# Altium project DLH_Project.PrjPCB
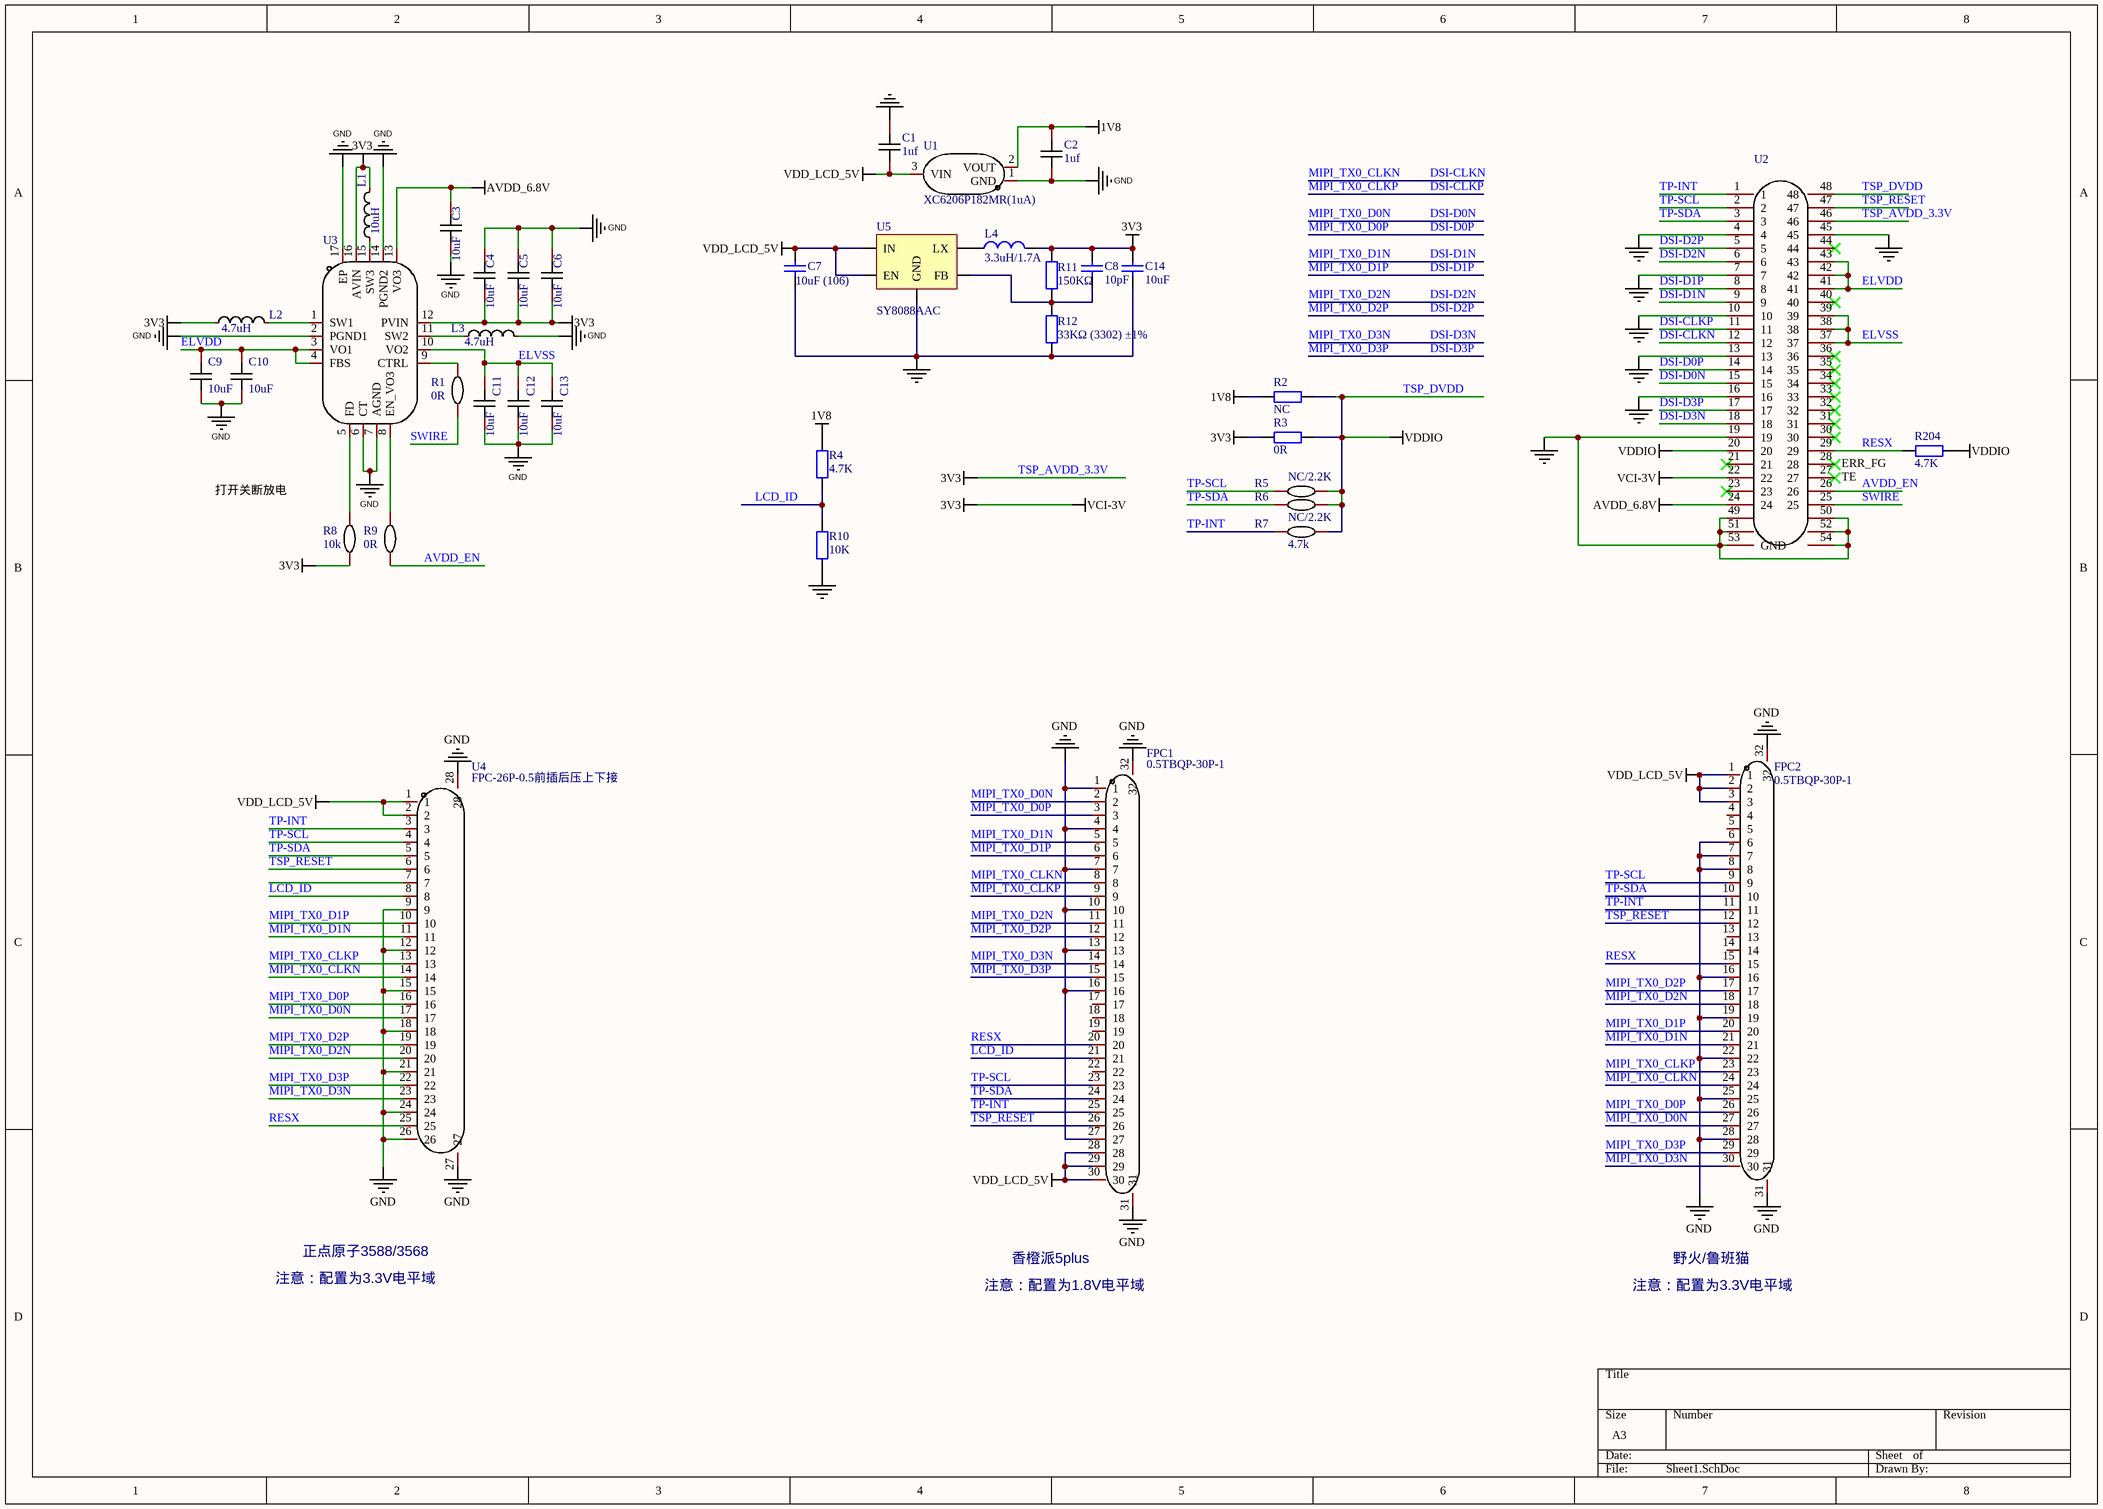
[diagram p0: Sheet1.SchDoc]
1 sheet, 38 parts. Net scope: global (net labels, ports and power ports of the same name join across sheets).
Board file: PCB1.PcbDoc

## Sheet Sheet1.SchDoc
size A3

### Parts
C1  1uf  [C0603]
C2  1uf  [C0603]
C3  10uF  [C0603]
C4  10uF  [C0603]
C5  10uF  [C0603]
C6  10uF  [C0603]
C7  10uF (106)  [C 0603]
C8  10pF  [C 0603]
C9  10uF  [C0603]
C10  10uF  [C0603]
C11  10uF  [C0603]
C12  10uF  [C0603]
C13  10uF  [C0603]
C14  10uF  [C 0603]
FPC1  0.5TBQP-30P-1  [FPC-SMD_30P-P0.50_0.5TBQS-30P-1]
FPC2  0.5TBQP-30P-1  [FPC-SMD_30P-P0.50_0.5TBQS-30P-1]
L1  10uH  [IND-SMD_L2.7-W2.0]
L2  4.7uH  [IND-SMD_L2.7-W2.0]
L3  4.7uH  [IND-SMD_L2.7-W2.0]
L4  3.3uH/1.7A  [1008]
R1  0R  [R0603]
R2  NC  [R 0603]
R3  0R  [R 0603]
R4  4.7K  [R 0603]
R5  NC/2.2K  [R0603]
R6  NC/2.2K  [R0603]
R7  4.7k  [R0603]
R8  10k  [R0603]
R9  0R  [R0603]
R10  10K  [R 0603]
R11  150KΩ  [R 0603]
R12  33KΩ (3302) ±1%  [R 0603]
R204  4.7K  [R 0603]
U1  XC6206P182MR(1uA)  [SOT-23-3_L2.9-W1.6-P1.90-LS2.8-BR]
U2  24-5857-048-201-829+  [BTB-24-5857-048]  (value not drawn)
U3  SGM3836AYTQ16G/TR  [TQFN-16_L3.0-W3.0-P0.50-BL-EP1.7]  (value not drawn)
U4  FPC-26P-0.5前插后压上下接  [FPC-SMD_26P-P0.50_C9900017209]
U5  SY8088AAC  [SOT23-5N]

### Nets
1V8: C2.1 R2.1 R4.1 U1.2(VOUT)
AVDD_6.8V: C3.2 U2.24 U3.13(VO3)
GND: C1.1 C2.2 C3.1 C4.2 C5.2 C6.2 C7.1 C9.1 C10.1 C11.1 C12.1 C13.1 C14.1 FPC1.1 FPC1.4 FPC1.7 FPC1.10 FPC1.13 FPC1.16 FPC1.27 FPC1.31 FPC1.32 FPC2.6 FPC2.7 FPC2.8 FPC2.16 FPC2.19 FPC2.22 FPC2.25 FPC2.28 FPC2.31 FPC2.32 L3.2 R10.1 R12.1 U1.1(GND) U2.4 U2.7 U2.10 U2.13 U2.16 U2.19 U2.45 U2.49 U2.50 U2.51 U2.52 U2.53(GND) U2.54 U3.2(PGND1) U3.6(CT) U3.7(AGND) U3.14(PGND2) U3.17(EP) U4.9 U4.12 U4.15 U4.18 U4.21 U4.24 U4.26 U4.27 U4.28 U5.2(GND)
TSP_AVDD_3.3V: C4.1 C5.1 C6.1 C8.2 C14.2 L1.2 L2.1 L4.2 R3.1 R8.1 R11.2 U2.22 U2.46 U3.12(PVIN) U3.16(AVIN)  [also labelled 3V3, VCI-3V]
TSP_DVDD: R2.2 R3.2 R5.2 R6.2 R7.2 R204.2 U2.20 U2.48  [also labelled VDDIO]
VDD_LCD_5V: C1.2 C7.2 FPC1.28 FPC1.29 FPC1.30 FPC2.1 FPC2.2 FPC2.3 U1.3(VIN) U4.1 U4.2 U5.1(EN) U5.4(IN)
AVDD_EN: R9.1 U2.26
DSI-CLKN: FPC1.8 FPC2.24 U2.12 U4.14  [also labelled MIPI_TX0_CLKN]
DSI-CLKP: FPC1.9 FPC2.23 U2.11 U4.13  [also labelled MIPI_TX0_CLKP]
DSI-D0N: FPC1.2 FPC2.27 U2.15 U4.17  [also labelled MIPI_TX0_D0N]
DSI-D0P: FPC1.3 FPC2.26 U2.14 U4.16  [also labelled MIPI_TX0_D0P]
DSI-D1N: FPC1.5 FPC2.21 U2.9 U4.11  [also labelled MIPI_TX0_D1N]
DSI-D1P: FPC1.6 FPC2.20 U2.8 U4.10  [also labelled MIPI_TX0_D1P]
DSI-D2N: FPC1.11 FPC2.18 U2.6 U4.20  [also labelled MIPI_TX0_D2N]
DSI-D2P: FPC1.12 FPC2.17 U2.5 U4.19  [also labelled MIPI_TX0_D2P]
DSI-D3N: FPC1.14 FPC2.30 U2.18 U4.23  [also labelled MIPI_TX0_D3N]
DSI-D3P: FPC1.15 FPC2.29 U2.17 U4.22  [also labelled MIPI_TX0_D3P]
ELVDD: C9.2 C10.2 U2.41 U2.42 U2.43 U3.3(VO1) U3.4(FBS)
ELVSS: C11.2 C12.2 C13.2 U2.37 U2.38 U2.39 U3.10(VO2)
LCD_ID: FPC1.21 R4.2 R10.2 U4.8
RESX: FPC1.20 FPC2.15 R204.1 U2.29 U4.25
SWIRE: R1.1 U2.25
TP-INT: FPC1.25 FPC2.11 R7.1 U2.1 U4.3
TP-SCL: FPC1.23 FPC2.9 R5.1 U2.2 U4.4
TP-SDA: FPC1.24 FPC2.10 R6.1 U2.3 U4.5
TSP_RESET: FPC1.26 FPC2.12 U2.47 U4.6
NetC8_1: C8.1 R11.1 R12.2 U5.5(FB)
NetL1_1: L1.1 U3.15(SW3)
NetL2_2: L2.2 U3.1(SW1)
NetL3_1: L3.1 U3.11(SW2)
NetL4_1: L4.1 U5.3(LX)
NetR1_2: R1.2 U3.9(CTRL)
NetR8_2: R8.2 U3.5(FD)
NetR9_2: R9.2 U3.8(EN_VO3)

Not connected (* = marked no-connect by the designer): FPC1 17 18 19 22; FPC2 4 5 13 14; U2 21* 23* 27* 28* 30* 31* 32* 33* 34* 35* 36* 40* 44*; U4 7

### Notes on the sheet
- 打开关断放电
- (near U2) TE
- ERR_FG
- 正点原子3588/3568
- 香橙派5plus
- 野火/鲁班猫
- 注意：配置为3.3V电平域
- 注意：配置为1.8V电平域

### Library data of the parts
C1-C6 C9-C13 = CAP_0603: Symbol: CapAcitance; Convert to PCB: yes; Device: CAP_0603; Add into BOM: yes; Supplier Footprint: 0603
  C1 C2: Name: 1uf; Value: 1uf
  C3-C6 C9-C13: Name: 10uF; Value: 10uF
C7 C14 = 0603 10uF (106) 10% 10V: 贴片电容; ComponentLink1Description: 供应商链接; ComponentLink1URL: http://www.szlcsc.com/product/details_20411.html; Package: 0603; Supplier: LC; SuppliersPartNumber: C19702
C8 = 0402 10pF (100) 5% 50V: 贴片电容; ComponentLink1Description: 供应商链接; ComponentLink1URL: http://www.szlcsc.com/product/details_33914.html; Package: 0402; Supplier: LC; SuppliersPartNumber: C32949
FPC1 FPC2 = 0.5TBQP-30P-1: Add into BOM: yes; Name: 0.5TBQP-30P-1; Symbol: 0.5TBQP-30P-1; Device: 0.5TBQP-30P-1; LCSC Part Name: 0.5TBQP-30P-1; Supplier Part: C3975120; Manufacturer Part: 0.5TBQP-30P-1; Supplier Footprint: FPC-30P-0.5mm; JLCPCB Part Class: 扩展库; Supplier: LCSC; Convert to PCB: yes
L1-L3 = GNR2512PA-2R2M: 电感值:2.2uH;精度:±20%;额定电流:1.3A;; Manufacturer: gotrend(高创科技); Add into BOM: yes; Tolerance: ±20%; Rated Current: 1.3A; DC Resistance (DCR): 155mΩ; Symbol: GNR2512PA-2R2M; Device: GNR2512PA-2R2M; LCSC Part Name: 2.2uH ±20%; Supplier Part: C142404; Manufacturer Part: GNR2512PA-2R2M; Supplier Footprint: SMD,2.7x2.2x1.2mm; JLCPCB Part Class: 扩展库; Datasheet: https://atta.szlcsc.com/upload/public/pdf/source/20171113/C142411_15105615305361115979.pdf; Supplier: LCSC; Convert to PCB: yes
  L1: Name: 10uH; Value: 10uH
  L2 L3: Name: 4.7uH; Value: 4.7uH
L4 = Inductor: 电感
R1 R5-R9 = Res_0603: Symbol: 电阻; Convert to PCB: yes; Device: Res_0603; Add into BOM: yes; Supplier Footprint: 0603
  R1 R9: Name: 0R; Value: 0R
  R5 R6: Name: NC/2.2K; Value: NC/2.2K
  R7: Name: 4.7k; Value: 4.7k
  R8: Name: 10k; Value: 10k
R2-R4 R10 R204 = R: 贴片电阻; 版权归属: 源创客; BOM名称: 贴片电阻; 学习资源: www.ooocke.com
R11 = 0402 150KΩ (1503) 1%: 贴片电阻; ComponentLink1Description: 供应商链接; ComponentLink1URL: http://www.szlcsc.com/product/details_26498.html; Package: 0402; Supplier: LC; SuppliersPartNumber: C25755
R12 = 0402 33KΩ (3302) 1%: 贴片电阻; ComponentLink1Description: 供应商链接; ComponentLink1URL: http://www.szlcsc.com/product/details_26522.html; Package: 0402; Supplier: LC; SuppliersPartNumber: C25779
U1 = XC6206P182MR(1uA): 输出类型:-;; Manufacturer: TECH PUBLIC(台舟); Add into BOM: yes; Name: XC6206P182MR(1uA); Symbol: XC6206P182MR(1UA); Device: XC6206P182MR(1uA); LCSC Part Name: XC6206P182MR(1uA); Supplier Part: C2827651; Manufacturer Part: XC6206P182MR(1uA); Supplier Footprint: SOT-23-3L; JLCPCB Part Class: Extended Part; Datasheet: https://atta.szlcsc.com/upload/public/pdf/source/20210427/C2827651_CB3194A7C09679308DE708B038C8109A.pdf; Supplier: LCSC; Convert to PCB: yes; Output Type: -
U2 = 24-5857-048-201-829+: Add into BOM: yes; Symbol: 24-5857-048; Device: 24-5857-048-201-829+; Convert to PCB: yes
U3 = SGM3836AYTQ16G/TR: Manufacturer: SGMICRO(圣邦微); Add into BOM: yes; Name: SGM3836AYTQ16G/TR; Symbol: SGM3836AYTQ16G/TR; Device: SGM3836AYTQ16G/TR; Supplier: LCSC; Supplier Part: C699665; Manufacturer Part: SGM3836AYTQ16G/TR; JLCPCB Part Class: 扩展库; LCSC Part Name: SGM3836AYTQ16G/TR; Supplier Footprint: TQFN-16-EP(3x3); Convert to PCB: yes
U4 = FPC-26P-0.5前插后压上下接: Add into BOM: yes; Name: FPC-26P-0.5前插后压上下接; Symbol: FPC-26P-0.5前插后压上下接; Device: FPC-26P-0.5前插后压上下接; LCSC Part Name: FPC-26P-0.5前插后压上下接; Supplier Part: C9900017209; Manufacturer Part: FPC-26P-0.5前插后压上下接; Supplier Footprint: FPC26-0_5; JLCPCB Part Class: 扩展库; Supplier: LCSC; Convert to PCB: yes
U5 = SY8088AAC: 1.5M 1A DCDC